# Altium schematic sheet BLUENRG-232.SchDoc
size A4
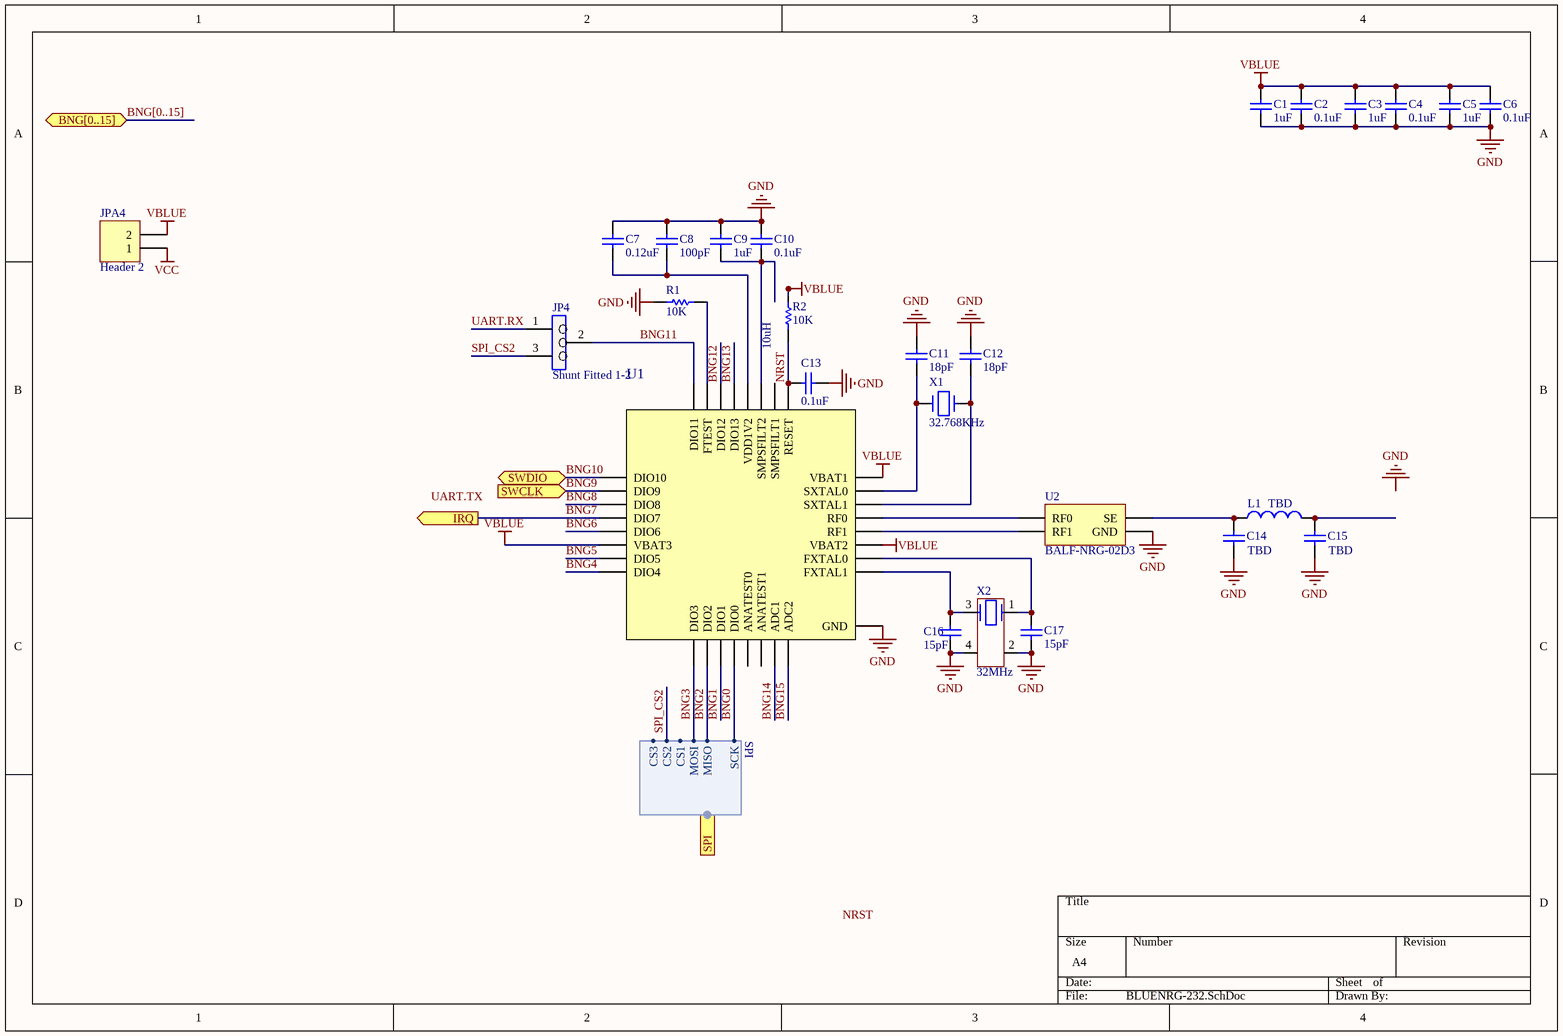
[diagram p0: BLUENRG-232.SchDoc]

## Parts
C1  value 1uF  [C0603[1608X92]]  (hidden comment: 1uF 6.3V 0603)
C2  value 0.1uF  [C0603[1608X92]]  (hidden comment: 0.1uF 6.3V 0603)
C3  value 1uF  [C0603[1608X92]]  (hidden comment: 1uF 6.3V 0603)
C4  value 0.1uF  [C0603[1608X92]]  (hidden comment: 0.1uF 6.3V 0603)
C5  value 1uF  [C0603[1608X92]]  (hidden comment: 1uF 6.3V 0603)
C6  value 0.1uF  [C0603[1608X92]]  (hidden comment: 0.1uF 6.3V 0603)
C7  value 0.12uF  [C0603[1608X92]]  (hidden comment: 0.12uF 10V 0603)
C8  value 100pF  [C0603[1608X92]]  (hidden comment: 100pF 10V 0603)
C9  value 1uF  [C0603[1608X92]]  (hidden comment: 1uF 6.3V 0603)
C10  value 0.1uF  [C0603[1608X92]]  (hidden comment: 0.1uF 6.3V 0603)
C11  value 18pF  [C0603[1608X92]]  (hidden comment: 18pF 50V 0603)
C12  value 18pF  [C0603[1608X92]]  (hidden comment: 18pF 50V 0603)
C13  value 0.1uF  [C0603[1608X92]]  (hidden comment: 0.1uF 16V 0603)
C14  CAPACITOR 0603  [C0603[1608X92]]  (value not drawn)
C15  CAPACITOR 0603  [C0603[1608X92]]  (value not drawn)
C16  value 15pF  [C0603[1608X92]]  (hidden comment: 15pF 50V 0603)
C17  value 15pF  [C0603[1608X92]]  (hidden comment: 15pF 50V 0603)
JP4  value Shunt Fitted 1-2  [HDR1X3]  (hidden comment: Jumper_Header 3x1 Fitted 1-2)
JPA4  Header 2  [HDR1X2]
L1  INDUCTOR 0603  [IND0603]  (value not drawn)
R1  value 10K  [R0603[1608]]  (hidden comment: 10K 1% 0603)
R2  value 10K  [R0603[1608]]  (hidden comment: 10K 1% 0603)
U1  BLUENRG-232  [QFPN-32-5x5mm]  (value not drawn)
U2  BALF-NRG-02D3  [CSPG-4 (0.4mm)]
X1  value 32.768KHz  [2-SMD]  (hidden comment: NX3215SA 32.768KHz)
X2  value 32MHz  [4-SMD]  (hidden comment: NX2016SA 32MHz)

## Ports
BNG[0..15] (bidir), IRQ (out), SPI (harness SPI), SWCLK (in), SWDIO (bidir)

## Harnesses
SPI: MOSI, MISO, SCK, CS1, CS2, CS3

## Nets
GND: C1.1 C2.1 C3.1 C4.1 C5.1 C6.1 C7.2 C8.2 C9.2 C10.2 C11.2 C12.2 C13.2 C14.1 C15.1 C16.1 C17.1 R1.2 U1.33(GND) U2.A2(GND) X2.2 X2.4
VBLUE: C1.2 C2.2 C3.2 C4.2 C5.2 C6.2 JPA4.2 R2.2 U1.6(VBAT3) U1.19(VBAT2) U1.24(VBAT1)
VCC: JPA4.1
BNG0: U1.12(DIO0) ; port SPI.SCK
BNG1: U1.11(DIO1)
BNG2: U1.10(DIO2) ; port SPI.MISO
BNG3: U1.9(DIO3) ; port SPI.MOSI
BNG4: U1.8(DIO4)
BNG5: U1.7(DIO5)
BNG6: U1.5(DIO6)
BNG7: U1.4(DIO7) ; port IRQ
BNG8: U1.3(DIO8)
BNG9: U1.2(DIO9) ; port SWCLK
BNG10: U1.1(DIO10) ; port SWDIO
BNG11: JP4.2 U1.32(DIO11)
BNG12: U1.30(DIO12)
BNG13: U1.29(DIO13)
BNG14: U1.15(ADC1)
BNG15: U1.16(ADC2)
NRST: C13.1 R2.1 U1.25(RESET)
SPI_CS2: JP4.3 ; port SPI.CS2
UART.RX: JP4.1
NetC7_1: C7.1 C8.1 U1.28(VDD1V2)
NetC9_1: C9.1 C10.1 U1.27(SMPSFILT2)
NetC11_1: C11.1 U1.23(SXTAL0) X1.1(X1)
NetC12_1: C12.1 U1.22(SXTAL1) X1.2(X2)
NetC14_2: C14.2 L1.1 U2.A1(SE)
NetC15_2: C15.2 L1.2
NetC16_2: C16.2 U1.17(FXTAL1) X2.3
NetC17_2: C17.2 U1.18(FXTAL0) X2.1
NetR1_1: R1.1 U1.31(FTEST)
NetU1_20: U1.20(RF1) U2.B2(RF1)
NetU1_21: U1.21(RF0) U2.B1(RF0)

Not connected (* = marked no-connect by the designer): U1 13(ANATEST0) 14(ANATEST1) 26(SMPSFILT1)

## Buses and harness runs
bus BNG[0..15] = port BNG[0..15]

## Notes on the sheet
- (near R2) 10uH
- (near L1) TBD
- (near C14) TBD
- (near C15) TBD
- Labels drawn without touching a wire or pin: GND, NRST, UART.TX

## Library data of the parts
C1 C3 C5 C9 = CAP_1uF_6.3V_0603_10%: 1uF 6.3V 10% 0603 (1608 Metric); PartNumber: GRM188R60J105KA01D; Manufacturer: Murata; TemperatureCoefficient: X5R; Mounting Technology: Surface Mount; PackageReference: 0603; PackageDescription: 0603 (1608 Metric); Voltage: 6.3V; Tolerance: 10%
C2 C4 C6 C10 = CAP_0.1uF_6.3V_0603_10%: 0.1uF 6.3V 10% 0603 (1608 Metric); PartNumber: GRM188R70J104KA01D; Manufacturer: Murata; Mounting Technology: Surface Mount; PackageReference: 0603; PackageDescription: 0603 (1608 Metric); Voltage: 6.3V; Tolerance: 10%
C7 = CAP_0.12uF_10V_0603_10%: 0.12uF 10V 10% 0603 (1608 Metric); PartNumber: GRM188R71A124KA01D; Manufacturer: Murata; TemperatureCoefficient: X7R; Mounting Technology: Surface Mount; PackageReference: 0603; PackageDescription: 0603 (1608 Metric); Voltage: 10V; Tolerance: 10%
C8 = CAP_100pF_10V_0603_10%: 100pF 10V 10% 0603 (1608 Metric); PartNumber: 885012206003; Manufacturer: Wurth; TemperatureCoefficient: X7R; Mounting Technology: Surface Mount; PackageReference: 0603; PackageDescription: 0603 (1608 Metric); Voltage: 10V; Tolerance: 10%
C11 C12 = CAP_18pF_50V_0603_1%: 18pF 50V 1% 0603 (1608 Metric); PartNumber: 06035A180FAT2A; Manufacturer: AVX Corporation; TemperatureCoefficient: C0G; Mounting Technology: Surface Mount; PackageReference: 0603; PackageDescription: 0603 (1608 Metric); Voltage: 50V; Tolerance: 1%
C13 = CAP_0.1uF_16V_0603_10%: 0.1uF 16V 10% 0603 (1608 Metric); PartNumber: GCM188R71C104KA37D; Manufacturer: Murata; TemperatureCoefficient: X7R; Mounting Technology: Surface Mount; PackageReference: 0603; PackageDescription: 0603 (1608 Metric); Voltage: 16V; Tolerance: 10%
C14 C15 = CAP 0603: Empty CAPACITOR 0603 (1608 Metric); Mounting Technology: Surface Mount; PackageReference: 0603; PackageDescription: 0603 (1608 Metric)
C16 C17 = CAP_15pF_50V_0603_1%: 15pF 50V 1% 0603 (1608 Metric); PartNumber: 06035A150FAT2A; Manufacturer: AVX Corporation; TemperatureCoefficient: C0G; Mounting Technology: Surface Mount; PackageReference: 0603; PackageDescription: 0603 (1608 Metric); Voltage: 50V; Tolerance: 1%
JP4 = Jumper_Header 3x1 Fitted 1-2: Header, 3x1, 2,54mm, VR, TH, Height 5.84mm/2.54mm - Shunt Fitted 1-2 by default; Internal_Part_Number: MCD-00684; Part_Type: Connector; Manufacturer_Part_Number: TSW-103-07-F-S; Manufacturer: SAMTEC; Provided_By: SUBCO; Status: Released; ComponentLink1Description: Datasheet; ComponentLink1URL: http://tunmcdsvn.tun.st.com/Component_Datasheet_Library/Trunk/Connectors/Samtec_TSW-HTSW-series; ECCN_US: n/a; ECCN_EU: n/a
JPA4 = Header 2: Header, 2-Pin; LatestRevisionDate: 17-Jul-2002; LatestRevisionNote: Re-released for DXP Platform.; Publisher: Altium Limited
L1 = IND 0603: Empty INDUCTOR 0603; PackageReference: 0603; PackageDescription: 0603 (1608 metric); Mounting Technology: Surface Mount
R1 R2 = RES_10K_0603_1%: 10K 0.25W 1% 0603 (1005 Metric); Manufacturer: Vishay / Dale; PartNumber: CRCW060310K0FKEAHP; Tolerance: 1%; Power: 0.25W; Mounting Technology: Surface Mount; PackageReference: 0603; PackageDescription: 0603 (1608 Metric); ComponentLink1Description: Datasheet; ComponentLink1URL: http://www.vishay.com/docs/20065/rcse3.pdf
U1 = BLUENRG-232: Manufacturer: STMicroelectronics; Part Number: BLUENRG-232; PackageReference: QFN-32; Mounting Technology: Surface Mount
U2 = BALF-NRG-02D3: 50 ohm nominal input / conjugate match to BlueNRG tranceiver; Manufacturer: STMicroelectronics; PartNumber: BALF-NRG-02D3; PackageReference: CSPG-4; Mounting Technology: Surface Mount
X1 = NX3215SA 32.768KHz: Crystal 32.768kHz, 6pF, +-20ppm, 50Kohms max, SMD; PartNumber: NX3215SA-32.768KHz-EXS00A-MU00525; Manufacturer: NDK; Mounting Technology: Surface Mount; PackageReference: 2-SMD; Type: Crystal_Osc
X2 = NX2016SA 32MHz: Crystal 32MHz, 6pF, +-10ppm, 60ohms max, SMD; PartNumber: NX2016SA-32MHZ-EXS00A-CS07977; Manufacturer: NDK; Mounting Technology: Surface Mount; PackageReference: 4-SMD; Type: Crystal_Osc